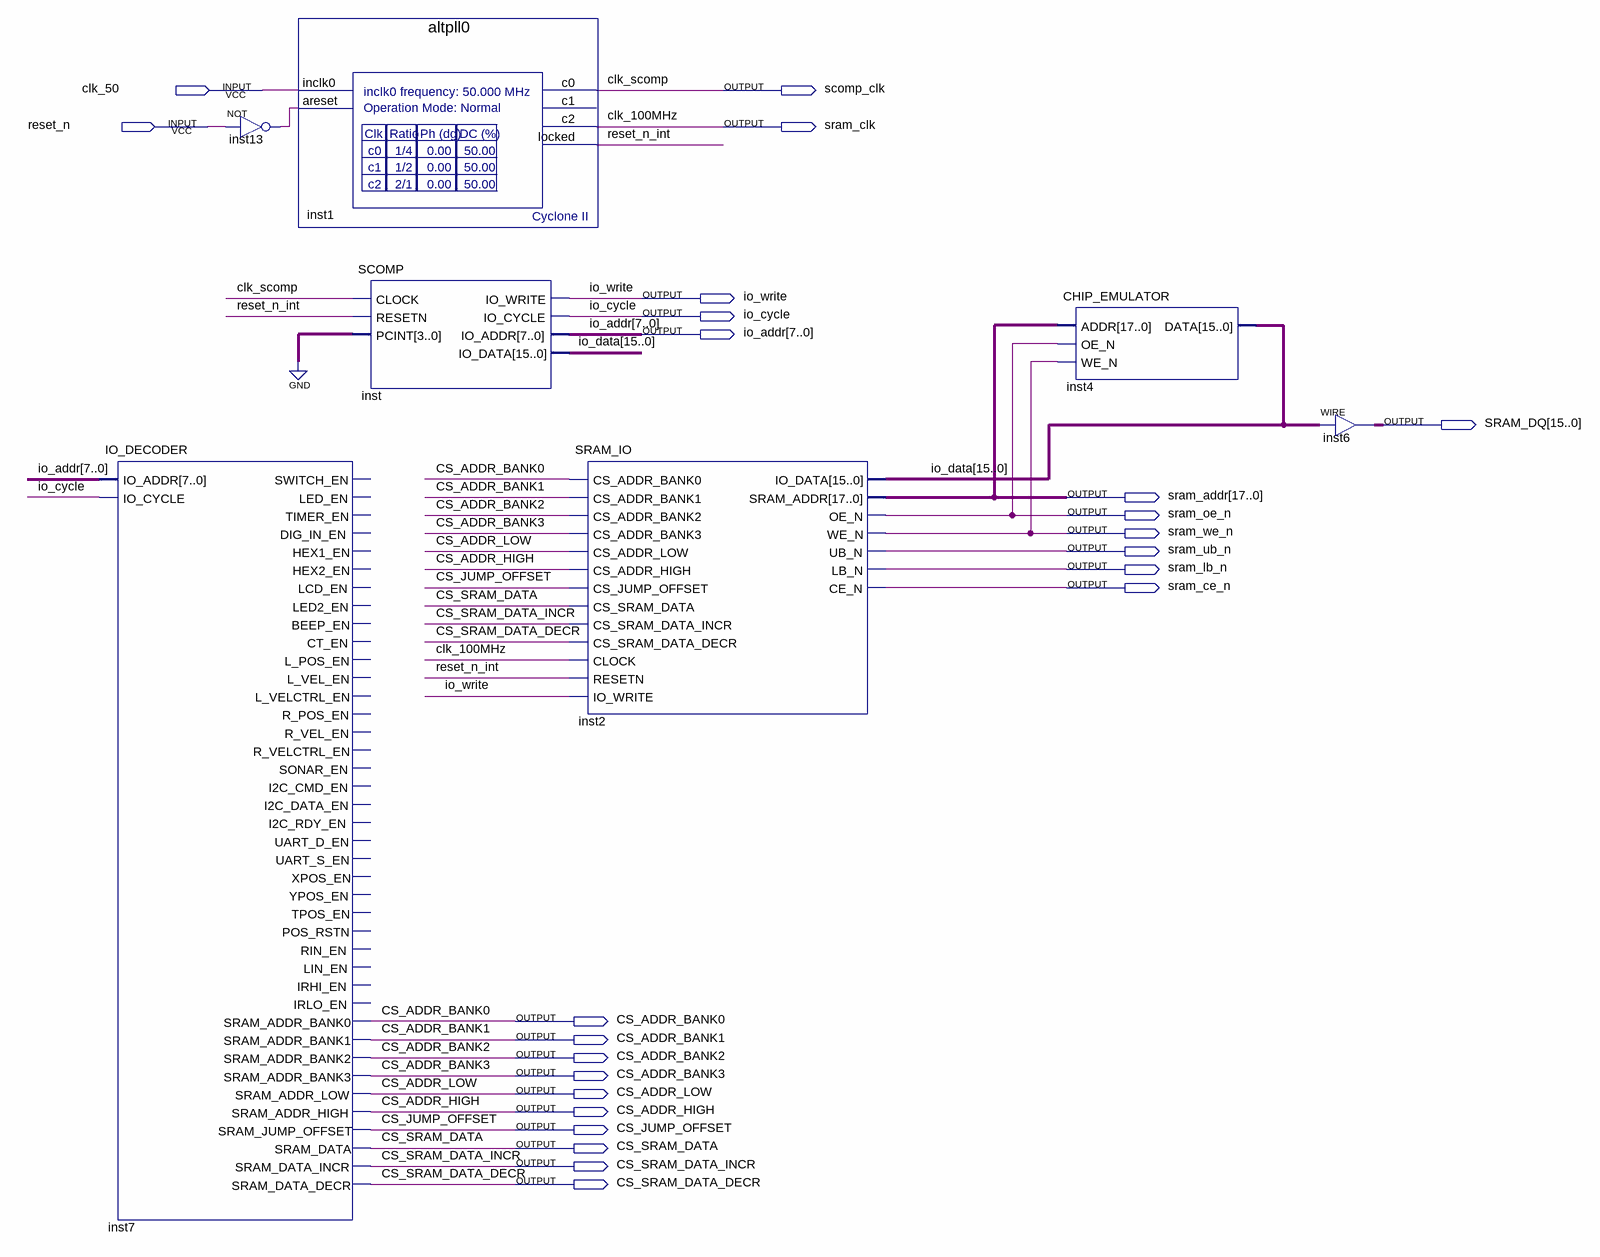
[diagram p0: schematic sheet]
// Quartus schematic SCOMP_SRAM.bdf as structural Verilog: 7 symbols, 24 pins
module SCOMP_SRAM (
  input  clk_50,
  input  reset_n,
  output scomp_clk,
  output sram_clk,
  output io_write,
  output io_cycle,
  output [7:0] io_addr,
  output [15:0] SRAM_DQ,
  output [17:0] sram_addr,
  output sram_oe_n,
  output sram_we_n,
  output sram_ub_n,
  output sram_lb_n,
  output sram_ce_n,
  output CS_ADDR_BANK0,
  output CS_ADDR_BANK1,
  output CS_ADDR_BANK2,
  output CS_ADDR_BANK3,
  output CS_ADDR_LOW,
  output CS_ADDR_HIGH,
  output CS_JUMP_OFFSET,
  output CS_SRAM_DATA,
  output CS_SRAM_DATA_INCR,
  output CS_SRAM_DATA_DECR
);

  wire inst13_out, reset_n_int;
  wire [15:0] io_data;

  IO_DECODER inst7 (
    .IO_ADDR(io_addr), .IO_CYCLE(io_cycle), .SRAM_ADDR_BANK0(CS_ADDR_BANK0), .SRAM_ADDR_BANK1(CS_ADDR_BANK1),
    .SRAM_ADDR_BANK2(CS_ADDR_BANK2), .SRAM_ADDR_BANK3(CS_ADDR_BANK3), .SRAM_ADDR_LOW(CS_ADDR_LOW),
    .SRAM_ADDR_HIGH(CS_ADDR_HIGH), .SRAM_JUMP_OFFSET(CS_JUMP_OFFSET), .SRAM_DATA(CS_SRAM_DATA),
    .SRAM_DATA_INCR(CS_SRAM_DATA_INCR), .SRAM_DATA_DECR(CS_SRAM_DATA_DECR));  // open: SWITCH_EN, LED_EN, TIMER_EN, DIG_IN_EN, HEX1_EN, HEX2_EN, LCD_EN, LED2_EN, BEEP_EN, CT_EN, L_POS_EN, L_VEL_EN, L_VELCTRL_EN, R_POS_EN, R_VEL_EN, R_VELCTRL_EN, SONAR_EN, I2C_CMD_EN, I2C_DATA_EN, I2C_RDY_EN, UART_D_EN, UART_S_EN, XPOS_EN, YPOS_EN, TPOS_EN, POS_RSTN, RIN_EN, LIN_EN, IRHI_EN, IRLO_EN
  not inst13 (inst13_out, reset_n);
  altpll0 inst1 (
    .inclk0(clk_50), .areset(inst13_out), .c0(scomp_clk), .c2(sram_clk), .locked(reset_n_int));  // open: c1
  SCOMP inst (
    .CLOCK(scomp_clk), .RESETN(reset_n_int), .PCINT(4'b0000), .IO_WRITE(io_write), .IO_CYCLE(io_cycle),
    .IO_ADDR(io_addr), .IO_DATA(io_data));
  SRAM_IO inst2 (
    .CS_ADDR_BANK0(CS_ADDR_BANK0), .CS_ADDR_BANK1(CS_ADDR_BANK1), .CS_ADDR_BANK2(CS_ADDR_BANK2),
    .CS_ADDR_BANK3(CS_ADDR_BANK3), .CS_ADDR_LOW(CS_ADDR_LOW), .CS_ADDR_HIGH(CS_ADDR_HIGH),
    .CS_JUMP_OFFSET(CS_JUMP_OFFSET), .CS_SRAM_DATA(CS_SRAM_DATA), .CS_SRAM_DATA_INCR(CS_SRAM_DATA_INCR),
    .CS_SRAM_DATA_DECR(CS_SRAM_DATA_DECR), .CLOCK(sram_clk), .RESETN(reset_n_int), .IO_WRITE(io_write),
    .SRAM_ADDR(sram_addr), .OE_N(sram_oe_n), .WE_N(sram_we_n), .UB_N(sram_ub_n), .LB_N(sram_lb_n),
    .CE_N(sram_ce_n), .IO_DATA(io_data));
  CHIP_EMULATOR inst4 (.ADDR(sram_addr), .OE_N(sram_oe_n), .WE_N(sram_we_n), .DATA(io_data));
  assign SRAM_DQ = io_data;  // WIRE inst6

  // Other names for the same wires on the sheet: clk_100MHz = sram_clk; clk_scomp = scomp_clk
endmodule
